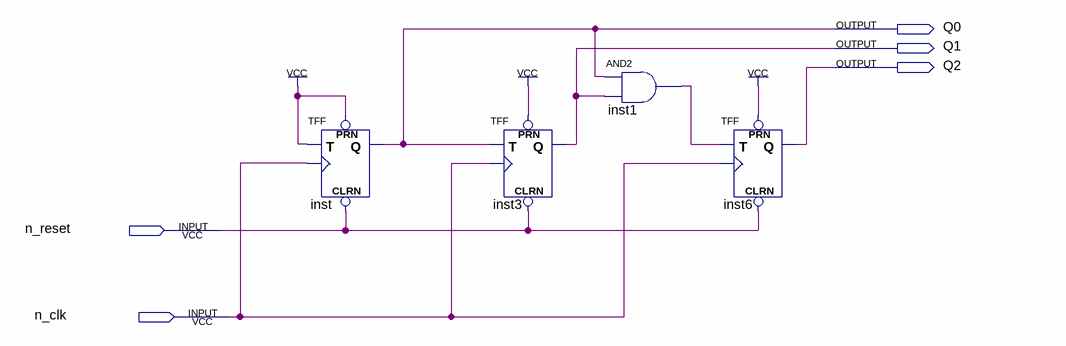
[diagram p0: schematic sheet]
// Quartus schematic 3bit counter.bdf as structural Verilog: 4 symbols, 5 pins
module \3bit_counter  (
  input  n_reset,
  input  n_clk,
  output Q0,
  output Q1,
  output Q2
);

  wire inst1_out;

  TFF inst (.PRN(1'b1), .CLRN(n_reset), .T(1'b1), .CLK(n_clk), .Q(Q0));
  TFF inst3 (.PRN(1'b1), .CLRN(n_reset), .T(Q0), .CLK(n_clk), .Q(Q1));
  and inst1 (inst1_out, Q0, Q1);
  TFF inst6 (.PRN(1'b1), .CLRN(n_reset), .T(inst1_out), .CLK(n_clk), .Q(Q2));
endmodule
